# EAGLE design zif_breakout_v20 (EAGLE 9.6.2)
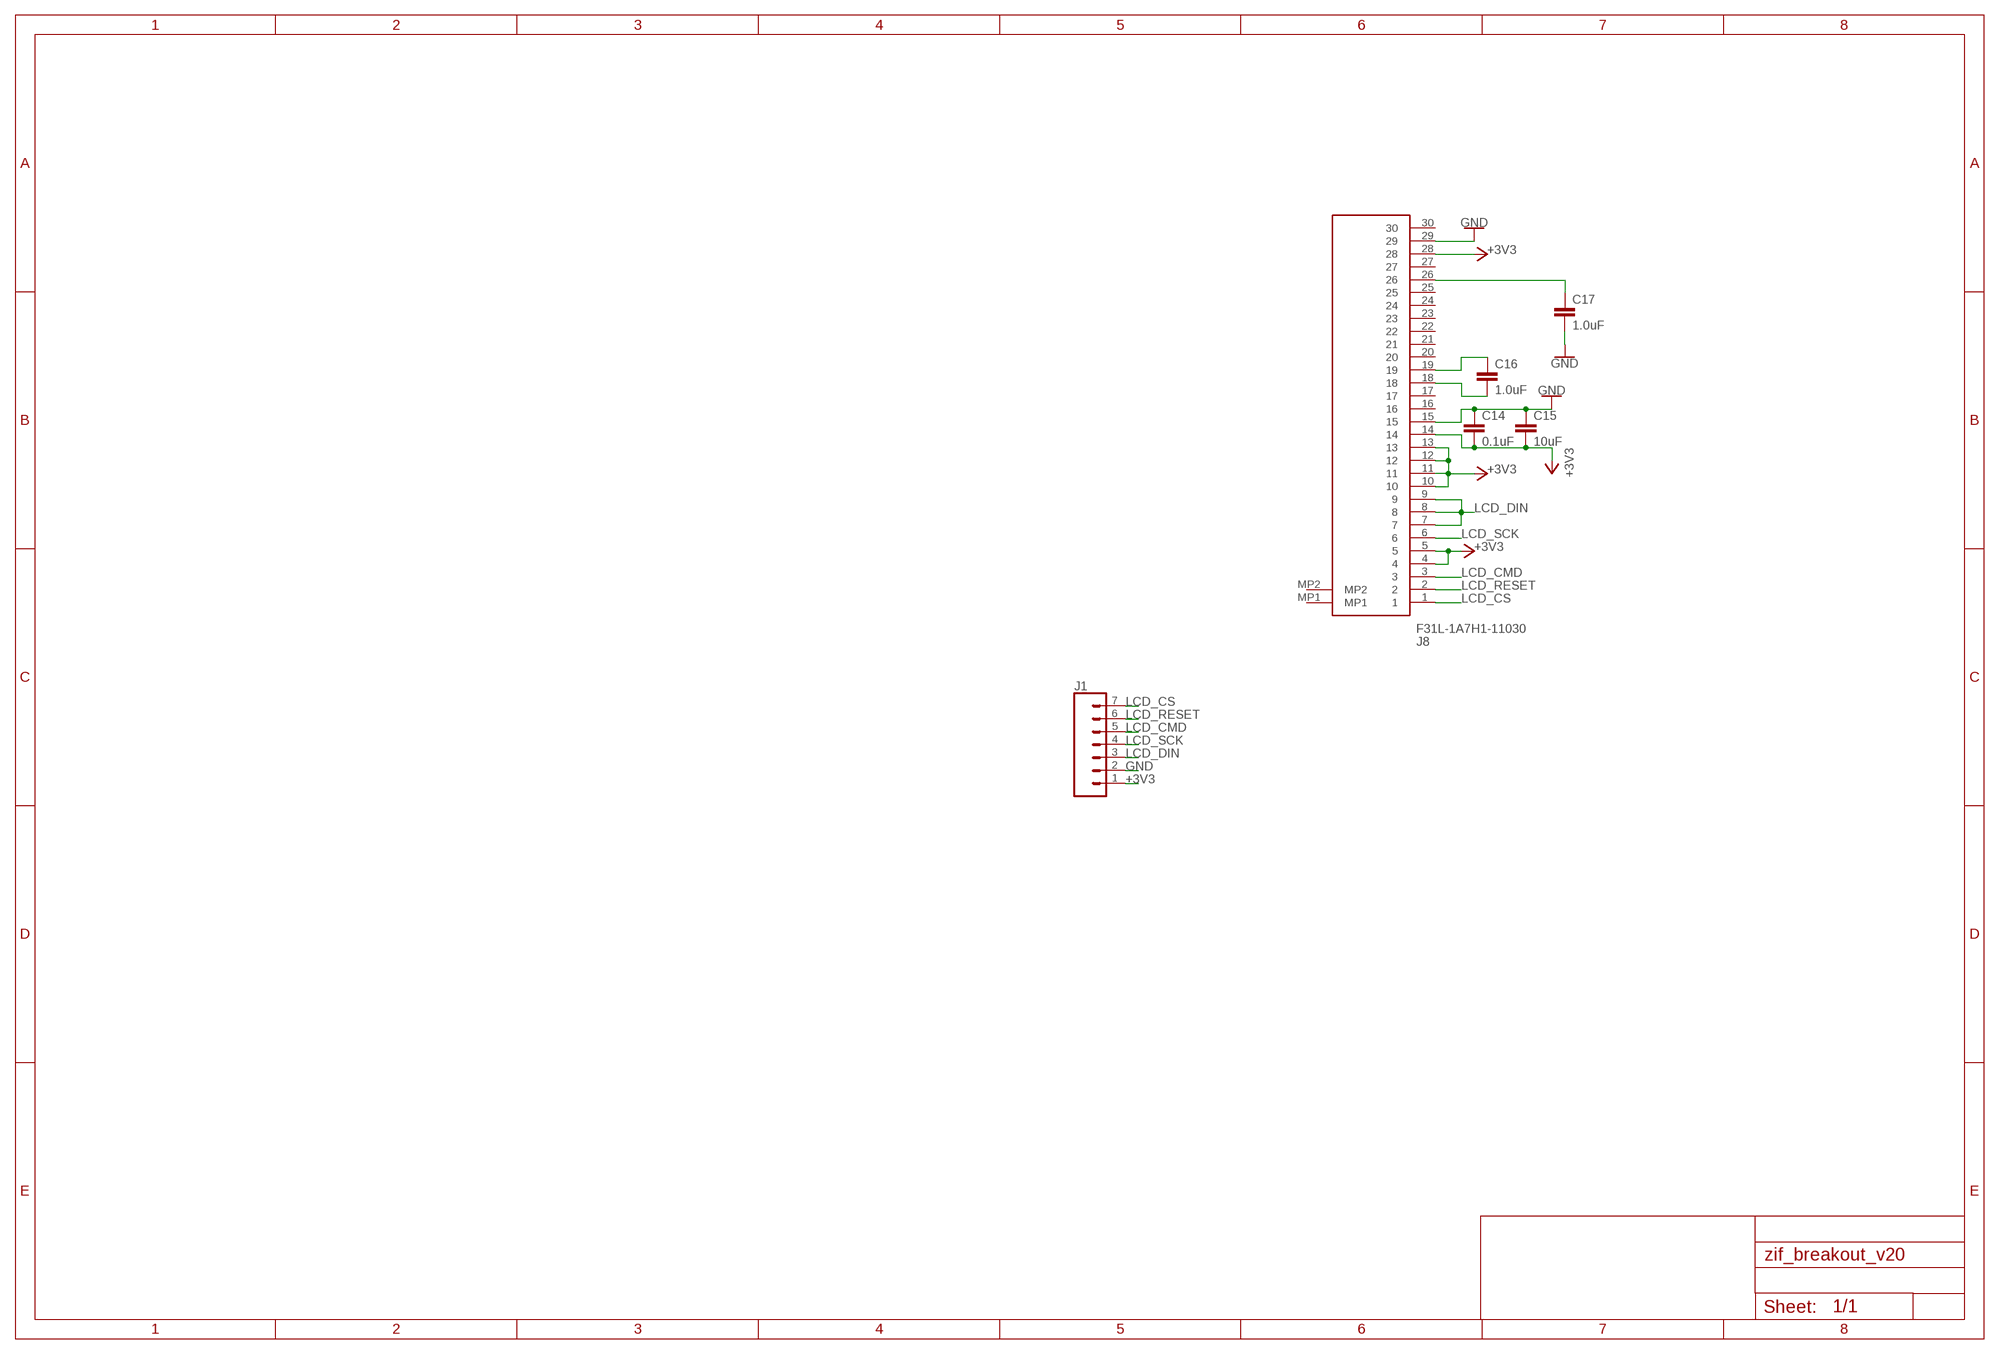
[diagram p0: schematic, sheet 1]

## Parts
C14  0.1uF  0.1UF-0603-25V-(+80/-20%)  [0603]
C15  10uF  10UF-0603-6.3V-20%  [0603]
C16  1.0uF  1.0UF-0603-16V-10%  [0603]
C17  1.0uF  1.0UF-0603-16V-10%  [0603]
J1  CONN_07  [1X07]
J8  F31L-1A7H1-11030  [F31L1A7H111030]

## Nets
+3V3: C14.2 C15.2 J1.1 J8.4 J8.5 J8.10 J8.11 J8.12 J8.13 J8.14 J8.28
GND: C14.1 C15.1 C17.2 J1.2 J8.15 J8.29
LCD_CMD: J1.5 J8.3
LCD_CS: J1.7 J8.1
LCD_DIN: J1.3 J8.7 J8.8 J8.9
LCD_RESET: J1.6 J8.2
LCD_SCK: J1.4 J8.6
N$1: C16.1 J8.19
N$3: C17.1 J8.26
N$12: C16.2 J8.18
Unconnected: J8.16 J8.17 J8.20 J8.21 J8.22 J8.23 J8.24 J8.25 J8.27 J8.30 J8.MP1 J8.MP2

## Library data of the parts
C14 = SparkFun-Capacitors:0.1UF: 0.1µF ceramic capacitors A capacitor is a passive two-terminal electrical component used to store electrical energy temporarily in an electric field.; PROD_ID: CAP-00810
C15 = SparkFun-Capacitors:10UF: 10.0µF ceramic capacitors A capacitor is a passive two-terminal electrical component used to store electrical energy temporarily in an electric field.; PROD_ID: CAP-11015
C16 C17 = SparkFun-Capacitors:1.0UF: 1µF ceramic capacitors A capacitor is a passive two-terminal electrical component used to store electrical energy temporarily in an electric field.; PROD_ID: CAP-00868
J1 = SparkFun-Connectors:CONN_07: Multi connection point. Often used as Generic Header-pin footprint for 0.1 inch spaced/style header connections On any of the 0.1 inch spaced packages, you can populate with these: Break Away Headers - Straight <https://www.sparkfun.com/products/116> (PRT-00116) Break Away Male Headers - Right Angle <https://www.sparkfun.com/products/553> (PRT-00553) Female Headers <https://www.sparkfun.com/products/115> (PRT-00115) Break Away Headers - Machine Pin <https://www.sparkfun.com/products/117> (PRT-00117) Break Away Female Headers - Swiss Machine Pin <https://www.sparkfun.com/products/743> (PRT-00743) For SCREWTERMINALS and SPRING TERMINALS visit here: Screw Terimnals on SparkFun.com <https://www.sparkfun.com/search/results?term=Screw+Terminals> (5mm/3.5mm/2.54mm spacing) This device is also useful as a general connection point to wire up your design to another part of your project. Our various solder wires solder well into these plated through hole pads. Hook-Up Wire - Assortment (Stranded, 22 AWG) <https://www.sparkfun.com/products/11375> (PRT-11375) Hook-Up Wire - Assortment (Solid Core, 22 AWG) <https://www.sparkfun.com/products/11367> (PRT-11367) View the entire wire category on our website here <https://www.sparkfun.com/categories/141> Special notes: Molex polarized connector foot print use with SKU : PRT-08231 with associated crimp pins and housings. 1MM SMD Version SKU: PRT-10208 NOTES ON THE VARIANTS LOCK and LOCK_LONGPADS... This footprint was designed to help hold the alignment of a through-hole component (i.e. 6-pin header) while soldering it into place. You may notice that each hole has been shifted either up or down by 0.005 of an inch from it's more standard position (which is a perfectly straight line). This slight alteration caused the pins (the squares in the middle) to touch the edges of the holes. Because they are alternating, it causes a "brace" to hold the component in place. 0.005 has proven to be the perfect amount of "off-center" position when using our standard breakaway headers. Although looks a little odd when you look at the bare footprint, once you have a header in there, the alteration is very hard to notice. Also,if you push a header all the way into place, it is covered up entirely on the bottom side.
J8 = F31L-1A7H1-11030:F31L-1A7H1-11030: Flex Connector, 0.50mm Pitch, Height 2.55mm, Right angle, Flip type, ZIF, 30 position , With MYLAR Source: Datasheet <https://cdn.amphenol-cs.com/media/wysiwyg/files/drawing/a-s0099-lf31l.pdf>; DESCRIPTION: Flex Connector, 0.50mm Pitch, Height 2.55mm, Right angle, Flip type, ZIF, 30 position , With MYLAR; HEIGHT: 2.75mm; MANUFACTURER_NAME: Amphenol; MANUFACTURER_PART_NUMBER: F31L-1A7H1-11030; MOUSER_PART_NUMBER: 649-F31L-1A7H1-11030; MOUSER_PRICE-STOCK: https://www.mouser.co.uk/ProductDetail/Amphenol-Aorora/F31L-1A7H1-11030?qs=xZ%2FP%252Ba9zWqba3JhFjnTbQA%3D%3D

## Board
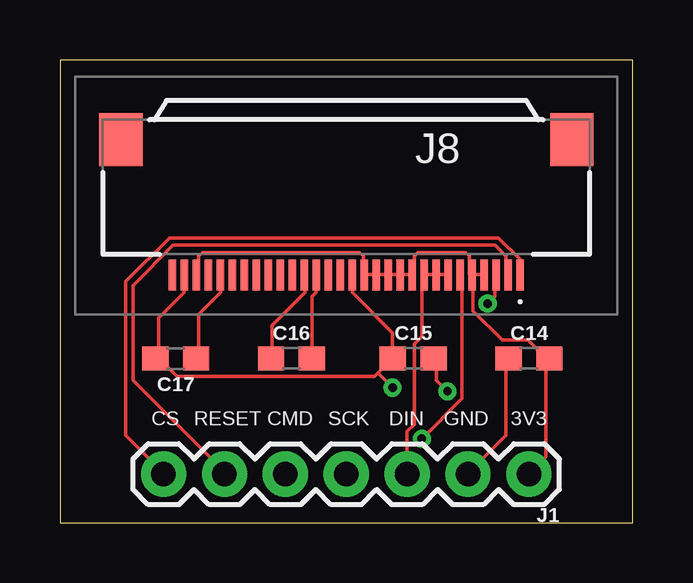
[diagram p1: board, top side]
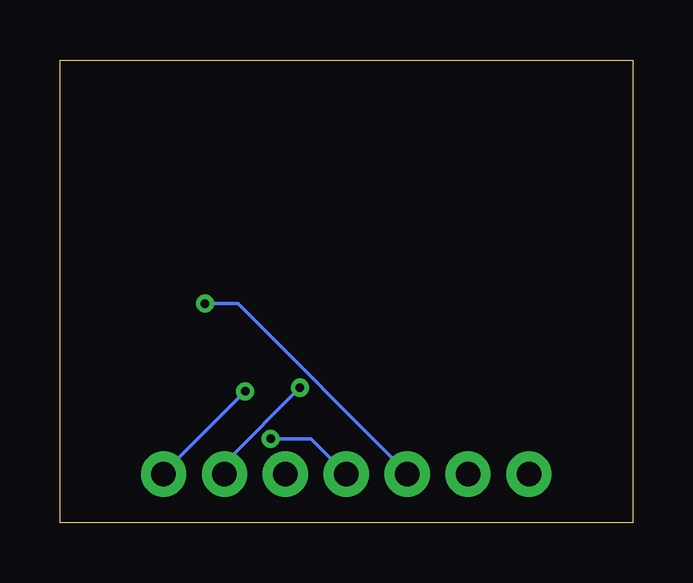
[diagram p2: board, bottom side, seen from below]

Size 23.88 x 19.3 mm. Coordinates in mm from the lower left corner, seen from the top.
Outline: 0,0 23.88,0 23.88,19.3 0,19.3 0,0
Copper layers (1*16): Top 0.035mm / dielectric 1.5mm / Bottom 0.035mm
Design rules "default": minimum track width 6mil, minimum drill 0.35mm, track to track 6mil, track to pad 6mil, pad to pad 6mil, via to via 6mil, smd to smd 6mil, copper to edge 40mil, drill to drill 6mil, minimum pad ring 10mil, minimum via ring 8mil, stop-mask expansion 4mil, vias tented up to drill 0mil, thermal gap 10mil

### Footprints (pad centres in the part's own frame; a part is rotated, then mirrored left to right if it is on the bottom)
0603 = smd 1.1 x 1: 1 -0.85,0; 2 0.85,0
1X07 = drill 1.016 pad 1.88: 1 0,0; 2 2.54,0; 3 5.08,0; 4 7.62,0; 5 10.16,0; 6 12.7,0; 7 15.24,0
F31L1A7H111030 = smd 0.3 x 1.3: 1 -7.25,3.64; 2 -6.75,3.64; 3 -6.25,3.64; 4 -5.75,3.64; 5 -5.25,3.64; 6 -4.75,3.64; 7 -4.25,3.64; 8 -3.75,3.64; 9 -3.25,3.64; 10 -2.75,3.64; 11 -2.25,3.64; 12 -1.75,3.64; 13 -1.25,3.64; 14 -0.75,3.64; 15 -0.25,3.64; 16 0.25,3.64; 17 0.75,3.64; 18 1.25,3.64; 19 1.75,3.64; 20 2.25,3.64; 21 2.75,3.64; 22 3.25,3.64; 23 3.75,3.64; 24 4.25,3.64; 25 4.75,3.64; 26 5.25,3.64; 27 5.75,3.64; 28 6.25,3.64; 29 6.75,3.64; 30 7.25,3.64 | smd 1.8 x 2.2: MP1 -9.4,-2.01; MP2 9.4,-2.01

### Placement (x,y rotation side)
C14  19.56,6.86 0 top
C15  14.73,6.86 0 top
C16  9.65,6.86 0 top
C17  4.83,6.86 180 top
J1  19.56,2.03 180 top
J8  11.94,13.97 180 top

### Tracks (layer width: path | path; a pad name or v marks a point on that pad's centre or on a via)
+3V3  (via drill 0.35)
  Top 0.152: J8.5 17.22,10.36 17.68,10.36 J8.4 | J8.28 5.79,10.36 5.79,11.12 5.94,11.28 12.5,11.28 12.65,11.12 12.65,10.36 J8.14 12.8,10.36 13.11,10.36 J8.13 13.26,10.36 13.56,10.36 J8.12 13.72,10.36 14.17,10.36 J8.11 14.33,10.36 14.63,10.36 J8.10 14.78,10.36 14.78,11.12 14.94,11.28 16.92,11.28 17.07,11.12 17.07,10.36 J8.5 | v16.15,5.49 15.7,5.94 15.7,6.86 C15.2 | 20.27,6.86 20.27,2.74 J1.1 | 20.27,6.86 19.51,7.62 18.44,7.62 17.22,8.84 17.22,10.21 J8.5 | 20.27,6.86 C14.2
  Bottom 0.152: v16.15,5.49 19.51,2.13 J1.1
GND  (via drill 0.35)
  Top 0.152: C14.1 18.59,6.86 18.59,3.66 17.07,2.13 J1.2 | 4.12,6.86 4.12,8.53 5.18,9.6 5.18,10.21 J8.29 | 13.87,6.86 13.87,7.92 12.19,9.6 12.19,10.21 J8.15 | 4.12,6.86 4.88,6.1 13.11,6.1 13.26,6.25 | 13.87,6.86 13.26,6.25 | 4.12,6.86 C17.2 | 13.87,6.86 C15.1 | 13.26,6.25 v13.87,5.64
  Bottom 0.152: v13.87,5.64 16.92,2.59 16.92,2.13 J1.2
LCD_CMD  (via drill 0.35)
  Top 0.152: v17.83,9.14 18.14,9.45 18.14,10.21 J8.3
  Bottom 0.152: v17.83,9.14 16.46,9.14 9.45,2.13 J1.5
LCD_CS
  Top 0.152: J8.1 19.2,10.36 19.2,10.97 18.29,11.89 4.57,11.89 2.74,10.06 2.74,3.66 4.27,2.13 J1.7
LCD_DIN
  Top 0.152: J8.7 16.15,10.36 15.7,10.36 J8.8 15.54,10.36 15.24,10.36 J8.9 15.09,10.21 15.09,7.77 14.78,7.47 14.78,4.12 14.48,3.81 J1.3
LCD_RESET
  Top 0.152: J8.2 18.59,10.36 18.59,11.12 18.14,11.58 4.72,11.58 3.05,9.91 3.05,5.94 6.86,2.13 J1.6
LCD_SCK  (via drill 0.35)
  Top 0.152: v15.09,3.5 16.76,5.18 16.76,10.21 J8.6
  Bottom 0.152: v15.09,3.5 13.41,3.5 J1.4
N$1
  Top 0.152: C16.1 8.84,6.86 8.84,8.23 10.21,9.6 10.21,10.21 J8.19
N$3
  Top 0.152: C17.1 5.79,6.86 5.79,8.69 6.71,9.6 6.71,10.21 J8.26
N$12
  Top 0.152: C16.2 10.52,6.86 10.52,9.45 10.67,9.6 10.67,10.21 J8.18

### Text on the board
tNames: CS | RESET | CMD | SCK | DIN | GND | 3V3